# EAGLE design v3 (EAGLE 7.6.0)
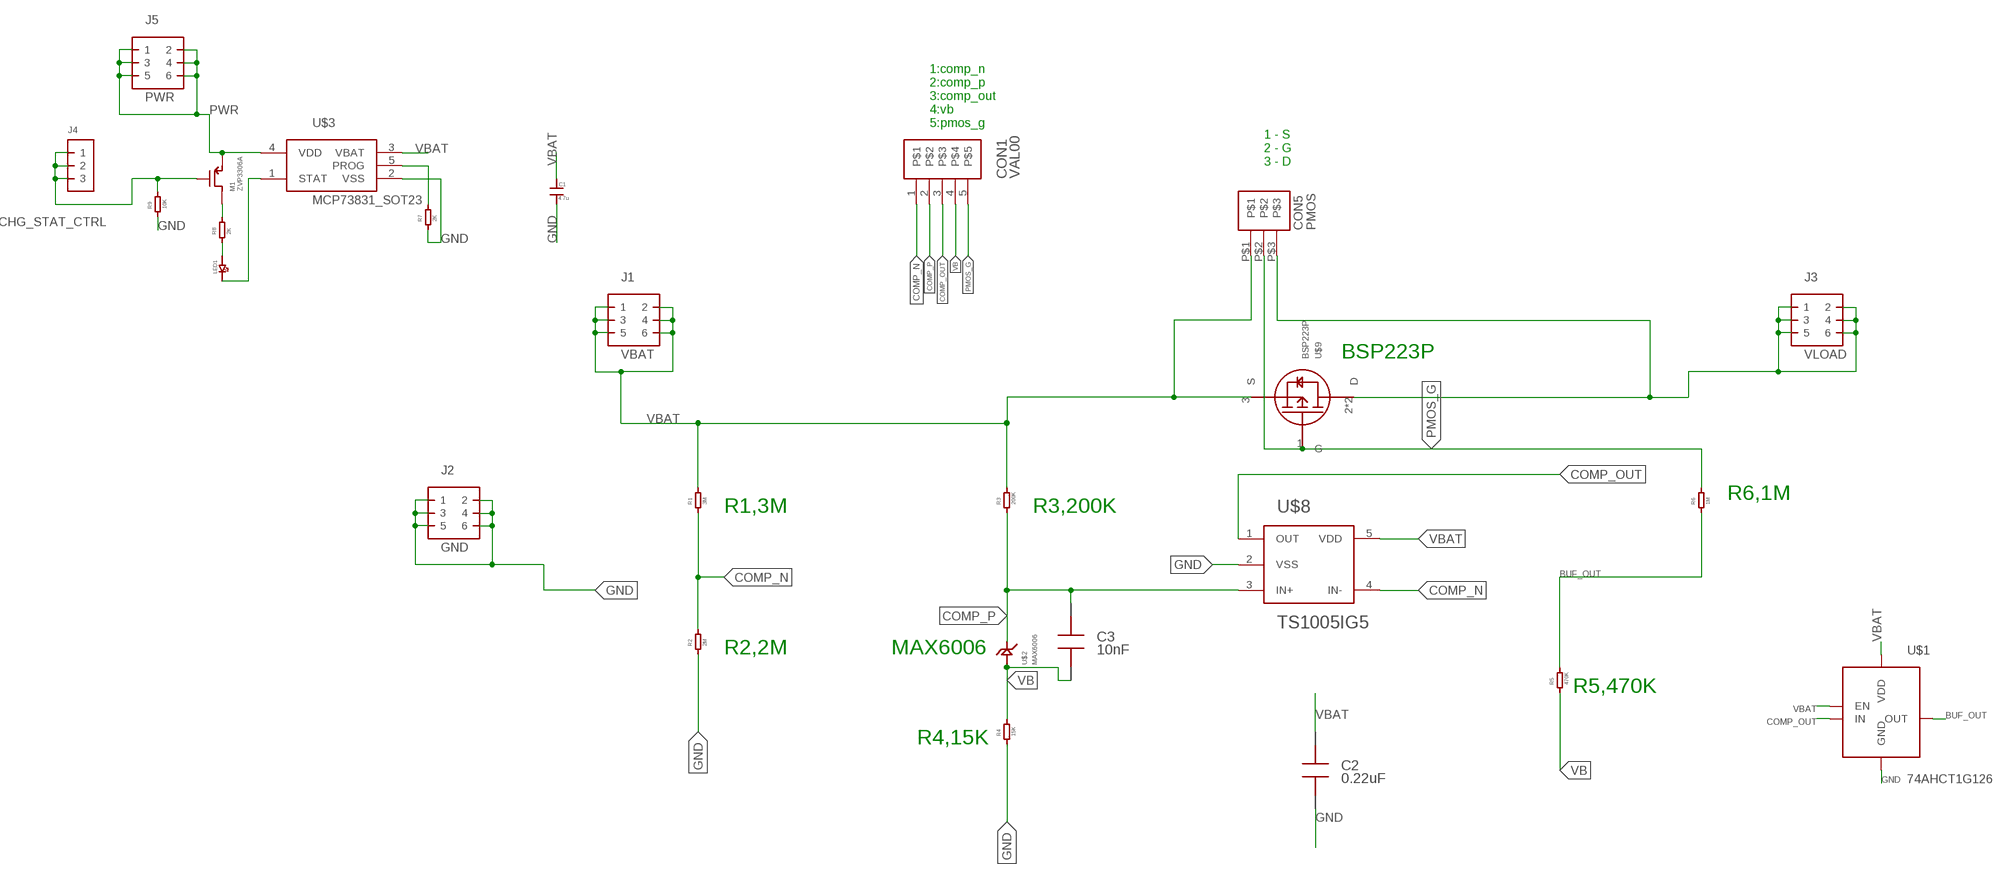
[diagram p0: schematic, sheet 1]

## Parts
C1  4.7u  GENERIC2012MM  [GRM21]
C2  0.22uF  UMK212F224ZD-T  [UMK212F224ZD-T]
C3  10nF  WALSIN_CAP_10NF  [WALSIN_CAP_0805(2012MM)]
CON1  VAL00  PINHD-1X5  [1X05_PH_2.54MM]
CON5  PMOS  PINHD-1X3  [1X03_PH_2.54MM]
J1  VBAT  2X3_2.54MM  [2X3_2.54MM]
J2  GND  2X3_2.54MM  [2X3_2.54MM]
J3  VLOAD  2X3_2.54MM  [2X3_2.54MM]
J4  1X3_2.54MM  [1X3_2.54MM]
J5  PWR  2X3_2.54MM  [2X3_2.54MM]
LED1  LG_R971-KN-1  [LG_R971-KN-1_2012]
M1  ZVP3306A  ZVP3306A_TO92_2.54MM  [ZVP3306A-TO92_2.54MM]
R1  3M  R_GENERIC2012MM  [ERJ2012]
R2  2M  R_GENERIC2012MM  [ERJ2012]
R3  200K  R_GENERIC2012MM  [ERJ2012]
R4  15K  R_GENERIC2012MM  [ERJ2012]
R5  470K  R_GENERIC2012MM  [ERJ2012]
R6  1M  R_GENERIC2012MM  [ERJ2012]
R7  2K  R_GENERIC2012MM  [ERJ2012]
R8  2K  R_GENERIC2012MM  [ERJ2012]
R9  10K  R_GENERIC2012MM  [ERJ2012]
U$1  74AHCT1G126  74AHCT1G126_SOT353  [74AHCT1G126-SOT353]
U$2  MAX6006  MAX6006_8SO  [8_SO_LP_90_0096]
U$3  MCP73831_SOT23  [MICROCHIP-SOT-23]
U$8  TS1005IG5  TS1005IG5CUSTOM_V1  [SILICONLABS-SOT23-5-G5_CUSTOM_V1]
U$9  BSP223P  BSP322PSMD  [INFINION-PG-SOT-223-4N]

## Nets
BUF_OUT: R5.P$1 R6.P$2 U$1.4(OUT)
CHG_STAT_CTRL: J4.P$1 J4.P$2 J4.P$3 M1.G R9.P$1
COMP_N: CON1.1 R1.P$2 R2.P$1 U$8.4(IN-)
COMP_OUT: CON1.3 U$1.2(IN) U$8.1(OUT)
COMP_P: C3.P$1 CON1.2 R3.P$2 U$2.6(OUT) U$2.8(OUT) U$8.3(IN+)
GND: C1.P$2 C2.P$2 J2.P$1 J2.P$2 J2.P$3 J2.P$4 J2.P$5 J2.P$6 R2.P$2 R4.P$2 R7.P$2 R9.P$2 U$1.3(GND) U$3.2(VSS) U$8.2(VSS)
N$2: LED1.A(CURRENT_IN) R8.P$2
N$3: R7.P$1 U$3.5(PROG)
N$4: CON5.P$3 J3.P$1 J3.P$2 J3.P$3 J3.P$4 J3.P$5 J3.P$6 U$9.2(D) U$9.4(D)
N$5: LED1.C(CURRENT_OUT) U$3.1(STAT)
N$6: M1.D R8.P$1
PMOS_G: CON1.5 CON5.P$2 R6.P$1 U$9.1(G)
PWR: J5.P$1 J5.P$2 J5.P$3 J5.P$4 J5.P$5 J5.P$6 M1.S U$3.4(VDD)
VB: C3.P$2 CON1.4 R4.P$1 R5.P$2 U$2.4(GND)
VBAT: C1.P$1 C2.P$1 CON5.P$1 J1.P$1 J1.P$2 J1.P$3 J1.P$4 J1.P$5 J1.P$6 R1.P$1 R3.P$1 U$1.1(EN) U$1.5(VDD) U$3.3(VBAT) U$8.5(VDD) U$9.3(S)

## Notes on the sheet
- 1:comp_n
  2:comp_p
  3:comp_out
  4:vb
  5:pmos_g
- 1 - S
  2 - G
  3 - D
- BSP223P
- R6,1M
- R1,3M | R3,200K
- R2,2M | MAX6006
- R5,470K
- R4,15K

## Library data of the parts
C1 = CAPACITORS:GENERIC; SIZE_METRIC: 2012
C2 = user_test1:UMK212F224ZD-T
C3 = user_test1:WALSIN_CAP_10NF; SIZE_MM: 2012; VALUE: 0.01uF
CON1 = user_test1:PINHD-1X5
CON5 = user_test1:PINHD-1X3
J1-J3 J5 = CONNECTOR:2X3
J4 = CONNECTOR:1X3
LED1 = LED:LG_R971-KN-1
M1 = TRANSISTOR:ZVP3306A
R1-R9 = resistor:R_GENERIC; SIZE_METRIC: 2012
U$1 = ETC_IC:74AHCT1G126
U$2 = user_test1:MAX6006_8SO
U$3 = battery_charger:MCP73831
U$8 = user_test1:TS1005IG5
U$9 = user_test1:BSP322P

## Board
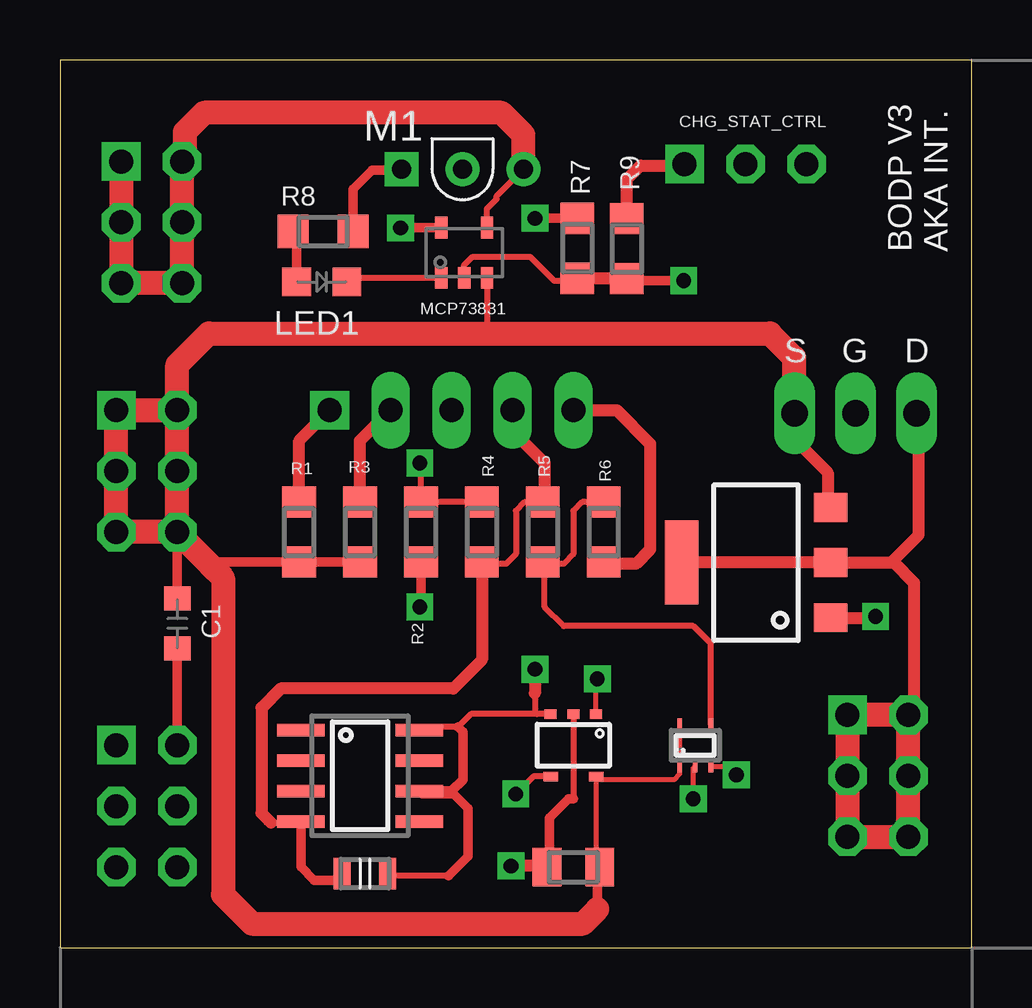
[diagram p1: board, top side]
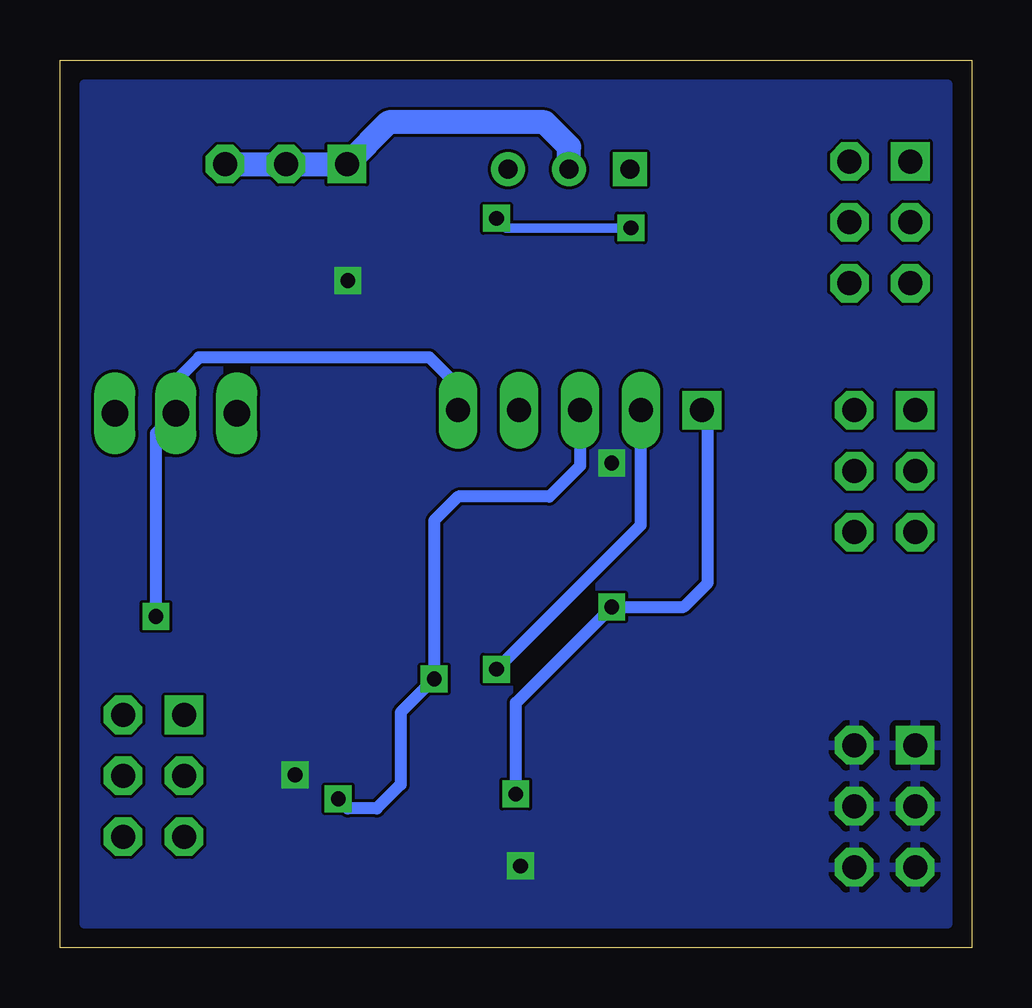
[diagram p2: board, bottom side, seen from below]

Size 38 x 37 mm. Coordinates in mm from the lower left corner, seen from the top.
Outline: 0,0 38,0 38,37 0,37 0,0
Copper layers (1*16): Top 0.035mm / dielectric 1.6mm / Bottom 0.035mm
Design rules "hsdt-custom-drc": minimum track width 0.125mm, minimum drill 0.2mm, track to track 0.125mm, track to pad 0.125mm, pad to pad 0.125mm, via to via 0.125mm, smd to smd 0.125mm, copper to edge 10mil, drill to drill 8mil, minimum pad ring 12mil, minimum via ring 10mil, stop-mask expansion 0.05mm, vias tented up to drill 0.2mm, thermal gap 10mil

### Footprints (pad centres in the part's own frame; a part is rotated, then mirrored left to right if it is on the bottom)
GRM21 = smd 1 x 1.1: P$1 -1.05,0; P$2 1.05,0
UMK212F224ZD-T = smd 1.2 x 1.6: P$1 1.1,0; P$2 -1.1,0
WALSIN_CAP_0805(2012MM) = smd 0.7 x 1.3: P$1 0.95,0; P$2 -0.95,0
1X05_PH_2.54MM = drill 1 square: 1 -5.08,0 | drill 1 long: 2 -2.54,0; 3 0,0; 4 2.54,0; 5 5.08,0
1X03_PH_2.54MM = drill 1.1 long: P$1 -2.54,0; P$2 0,0; P$3 2.54,0
2X3_2.54MM = drill 1 square: P$1 -1.27,1.27 | drill 1 octagon: P$2 1.27,1.27; P$3 -1.27,-1.27; P$4 1.27,-1.27; P$5 -1.27,-3.81; P$6 1.27,-3.81
1X3_2.54MM = drill 1 square: P$1 -2.54,0 | drill 1 octagon: P$2 0,0; P$3 2.54,0
LG_R971-KN-1_2012 = smd 1.2 x 1.2: A -1.05,0; C 1.05,0
ZVP3306A-TO92_2.54MM = drill 0.8 square: D -2.54,0 | drill 0.8: G 0,0; S 2.54,0
ERJ2012 = smd 1.3 x 1.4: P$1 -1.25,0; P$2 1.25,0
74AHCT1G126-SOT353 = smd 0.2 x 0.5: 1 0.65,0.875; 2 0,0.875; 3 -0.65,0.875; 4 -0.65,-0.875; 5 0.65,-0.875
8_SO_LP_90_0096 = smd 1.98 x 0.53: 1 -2.465,1.905; 2 -2.465,0.635; 3 -2.465,-0.635; 4 -2.465,-1.905; 5 2.465,-1.905; 6 2.465,-0.635; 7 2.465,0.635; 8 2.465,1.905
MICROCHIP-SOT-23 = smd 0.51 x 0.9: 1 -0.95,-1.05; 2 0,-1.05; 3 0.95,-1.05; 4 0.95,1.05; 5 -0.95,1.05
SILICONLABS-SOT23-5-G5_CUSTOM_V1 = smd 0.5 x 0.4: 1 0.95,1.3; 2 0,1.3; 3 -0.95,1.3 | smd 0.6 x 0.4: 4 -0.95,-1.3; 5 0.95,-1.3
INFINION-PG-SOT-223-4N = smd 1.4 x 1.2: 1 3.1,-2.3; 2 3.1,0; 3 3.1,2.3 | smd 1.4 x 3.5: 4 -3.1,0

### Placement (x,y rotation side)
C1  4.89,13.51 270 top
C2  21.4,3.35 0 top
C3  12.71,3.08 0 top
CON1  16.32,22.4 0 top
CON5  33.17,22.27 0 top
J1  3.62,21.13 0 top
J2  3.62,7.16 0 top
J3  34.1,8.43 0 top
J4  28.58,32.66 0 top
J5  3.82,31.5 0 top
LED1  10.91,27.75 0 top
M1  16.78,32.45 0 top
R1  9.97,17.32 90 top
R2  15.05,17.32 90 top
R3  12.51,17.32 90 top
R4  17.59,17.32 90 top
R5  20.13,17.32 90 top
R6  22.67,17.32 90 top
R7  21.57,29.15 270 top
R8  10.97,29.85 180 top
R9  23.63,29.13 270 top
U$1  26.48,8.43 180 top
U$2  12.51,7.16 0 top
U$3  16.85,28.96 0 top
U$8  21.4,8.43 0 top
U$9  29.02,16.05 0 top

### Tracks (layer width: path | path; a pad name or v marks a point on that pad's centre or on a via)
BUF_OUT
  Top 0.25: R6.P$2 21.77,18.57 21.4,18.2 21.4,16.4 21,16 20.2,16 | U$1.4 27.13,12.67 26.4,13.4 21,13.4 20.2,14.2 20.2,16 | 20.2,16 R5.P$1
CHG_STAT_CTRL
  Top 0.5: R9.P$1 23.63,32.03 24.2,32.6 25.98,32.6 J4.P$1
  Bottom 1: M1.G 16.78,33.38 17.8,34.4 24.3,34.4 J4.P$1 J4.P$2 J4.P$3
COMP_N  (via drill 0.61)
  Top 0.254: U$8.4 19.73,7.13 v19,6.4
  Top 0.4: R2.P$1 15.05,14.25 v15,14.2
  Top 0.5: R1.P$2 9.97,21.13 CON1.1
  Bottom 0.5: v19,6.4 19,10.2 v15,14.2 12,14.2 11,15.2 11,22.16 CON1.1
COMP_OUT  (via drill 0.61)
  Top 0.2: v26.4,6.2 26.4,7.47 U$1.2 | U$8.1 22.35,11.15 v22.4,11.2
  Bottom 0.5: CON1.3 16.32,20.08 17.6,18.8 21.4,18.8 22.4,17.8 v22.4,11.2 23.8,9.8 23.8,6.8 24.8,5.8 26,5.8 v26.4,6.2
COMP_P  (via drill 0.61)
  Top 0.25: 19.8,10.6 19.8,9.8
  Top 0.254: U$2.8 15.11,9.2 16.6,9.2 17.13,9.73 U$8.3 19.87,9.73 19.8,9.8 | 16.2,3 13.74,3 C3.P$1
  Top 0.4: 16.6,9.2 16.8,9 16.8,7 16.32,6.53 U$2.6 15.1,6.4 16.4,6.4 17,5.8 17,3.8 16.2,3
  Top 0.5: R3.P$2 12.51,21.13 CON1.2 | v19.8,11.6 19.8,10.6
  Bottom 0.254: 13.8,22.4 CON1.2
  Bottom 0.5: 13.8,22.4 13.8,17.6 v19.8,11.6
GND  (via drill 0.61)
  Top 0.2: U$1.3 27.84,7.55 v28.2,7.2
  Top 0.25: U$3.2 16.85,28.45 17.2,28.8 19.6,28.8 20.6,27.8 21.47,27.8 R7.P$2 | R4.P$2 R2.P$2 15.05,20.15 v15,20.2
  Top 0.254: U$8.2 21.4,6.2
  Top 0.4: C1.P$2 J2.P$2 | 21.4,6.2 21.2,6.2 20.4,5.4 20.4,3.45 C2.P$2 | v26,27.8 23.6,27.8 23.6,27.85 R9.P$2
  Top 0.5: R9.P$2 21.59,27.88 R7.P$2 | v18.8,3.4 20.2,3.4 20.25,3.35 C2.P$2
  Bottom 0.2: v28.2,7.2 28.2,7
  Bottom 0.25: v15,20.2 14.6,20.2
  pour Bottom: 1,36 1,1 37,1 37,36
N$2
  Top 0.4: LED1.A 9.86,29.71 R8.P$2
N$3  (via drill 0.61)
  Top 0.4: U$3.5 v14.21,30.01 v14.2,30 | v19.8,30.4 R7.P$1
  Bottom 0.4: v14.2,30 19.4,30 v19.8,30.4
N$4
  Top 0.254: 35.4,4.6 35.39,4.6 J3.P$6
  Top 0.5: 34.75,16.05 U$9.2 U$9.4 | 34.75,16.05 35.6,15.2 35.6,9.93 J3.P$2 | 34.75,16.05 34.75,16.15 35.8,17.2 35.8,22.18 CON5.P$3
  Top 1: J3.P$6 J3.P$4 J3.P$2 J3.P$1 J3.P$3 J3.P$5 | 35.4,4.6 32.8,4.6
N$5
  Top 0.25: U$3.1 12.12,27.91 LED1.C
N$6
  Top 0.4: R8.P$1 12.22,31.62 13,32.4 14.19,32.4 M1.D
PMOS_G  (via drill 0.61)
  Top 0.5: U$9.1 33.95,13.75 v34,13.8 | CON1.5 23.2,22.4 24.6,21 24.6,16.6 24,16 22.74,16 R6.P$1
  Bottom 0.5: v34,13.8 34,21.44 CON5.P$2 33.2,22.3 33.2,23.6 32.2,24.6 22.6,24.6 21.4,23.4 CON1.5
PWR
  Top 0.25: U$3.4 17.8,30.8 18.2,31.2 18.2,31.33 M1.S
  Top 1: J5.P$1 J5.P$3 J5.P$5 J5.P$6 J5.P$4 J5.P$2 5.2,32.88 5.2,34 6,34.8 18.4,34.8 19.32,33.88 M1.S
VB
  Top 0.25: 8.6,5.2 8.8,5.2 9.99,5.2 U$2.4 | R5.P$2 19.37,18.57 19,18.2 19,16.4 18.6,16 17.66,16 R4.P$1
  Top 0.4: U$2.4 10.04,3.35 10.6,2.8 11.48,2.8 C3.P$2
  Top 0.5: CON1.4 18.86,21.54 20.2,20.2 20.2,18.64 R5.P$2 | R4.P$1 17.59,11.99 16.4,10.8 9.2,10.8 8.4,10 8.4,5.6 8.8,5.2
VBAT
  Top 0.2: C2.P$1 22.35,3.5 U$8.5 22.48,7 25.6,7 25.83,7.23 U$1.1 U$1.5
  Top 0.25: U$3.3 17.8,25.6
  Top 0.4: J1.P$6 C1.P$1 | R3.P$1 R1.P$1 6.2,16.07 | 6.2,16.07 6.14,16.07 | 22.4,1.6 22.4,3.4 | 6.2,16 6.2,16.07
  Top 0.5: CON5.P$1 30.63,21.17 32,19.8 32,18.47 U$9.3 | 22.35,3.5 22.35,3.45 22.4,3.4
  Top 1: J1.P$2 J1.P$1 J1.P$3 J1.P$5 J1.P$6 | J1.P$2 J1.P$4 J1.P$6 | 6.14,16.07 J1.P$6 | J1.P$2 4.89,24.29 6.2,25.6 17.8,25.6 29.6,25.6 30.6,24.6 30.6,22.3 CON5.P$1 | 6.2,16 6.8,15.4 6.8,2.2 8,1 21.8,1 22.4,1.6

### Text on the board
tPlace: CHG_STAT_CTRL | BODP V3 / AKA INT. | MCP73831 | S | G | D